# EAGLE design SDI12IB_v0.4 (EAGLE 5.11)
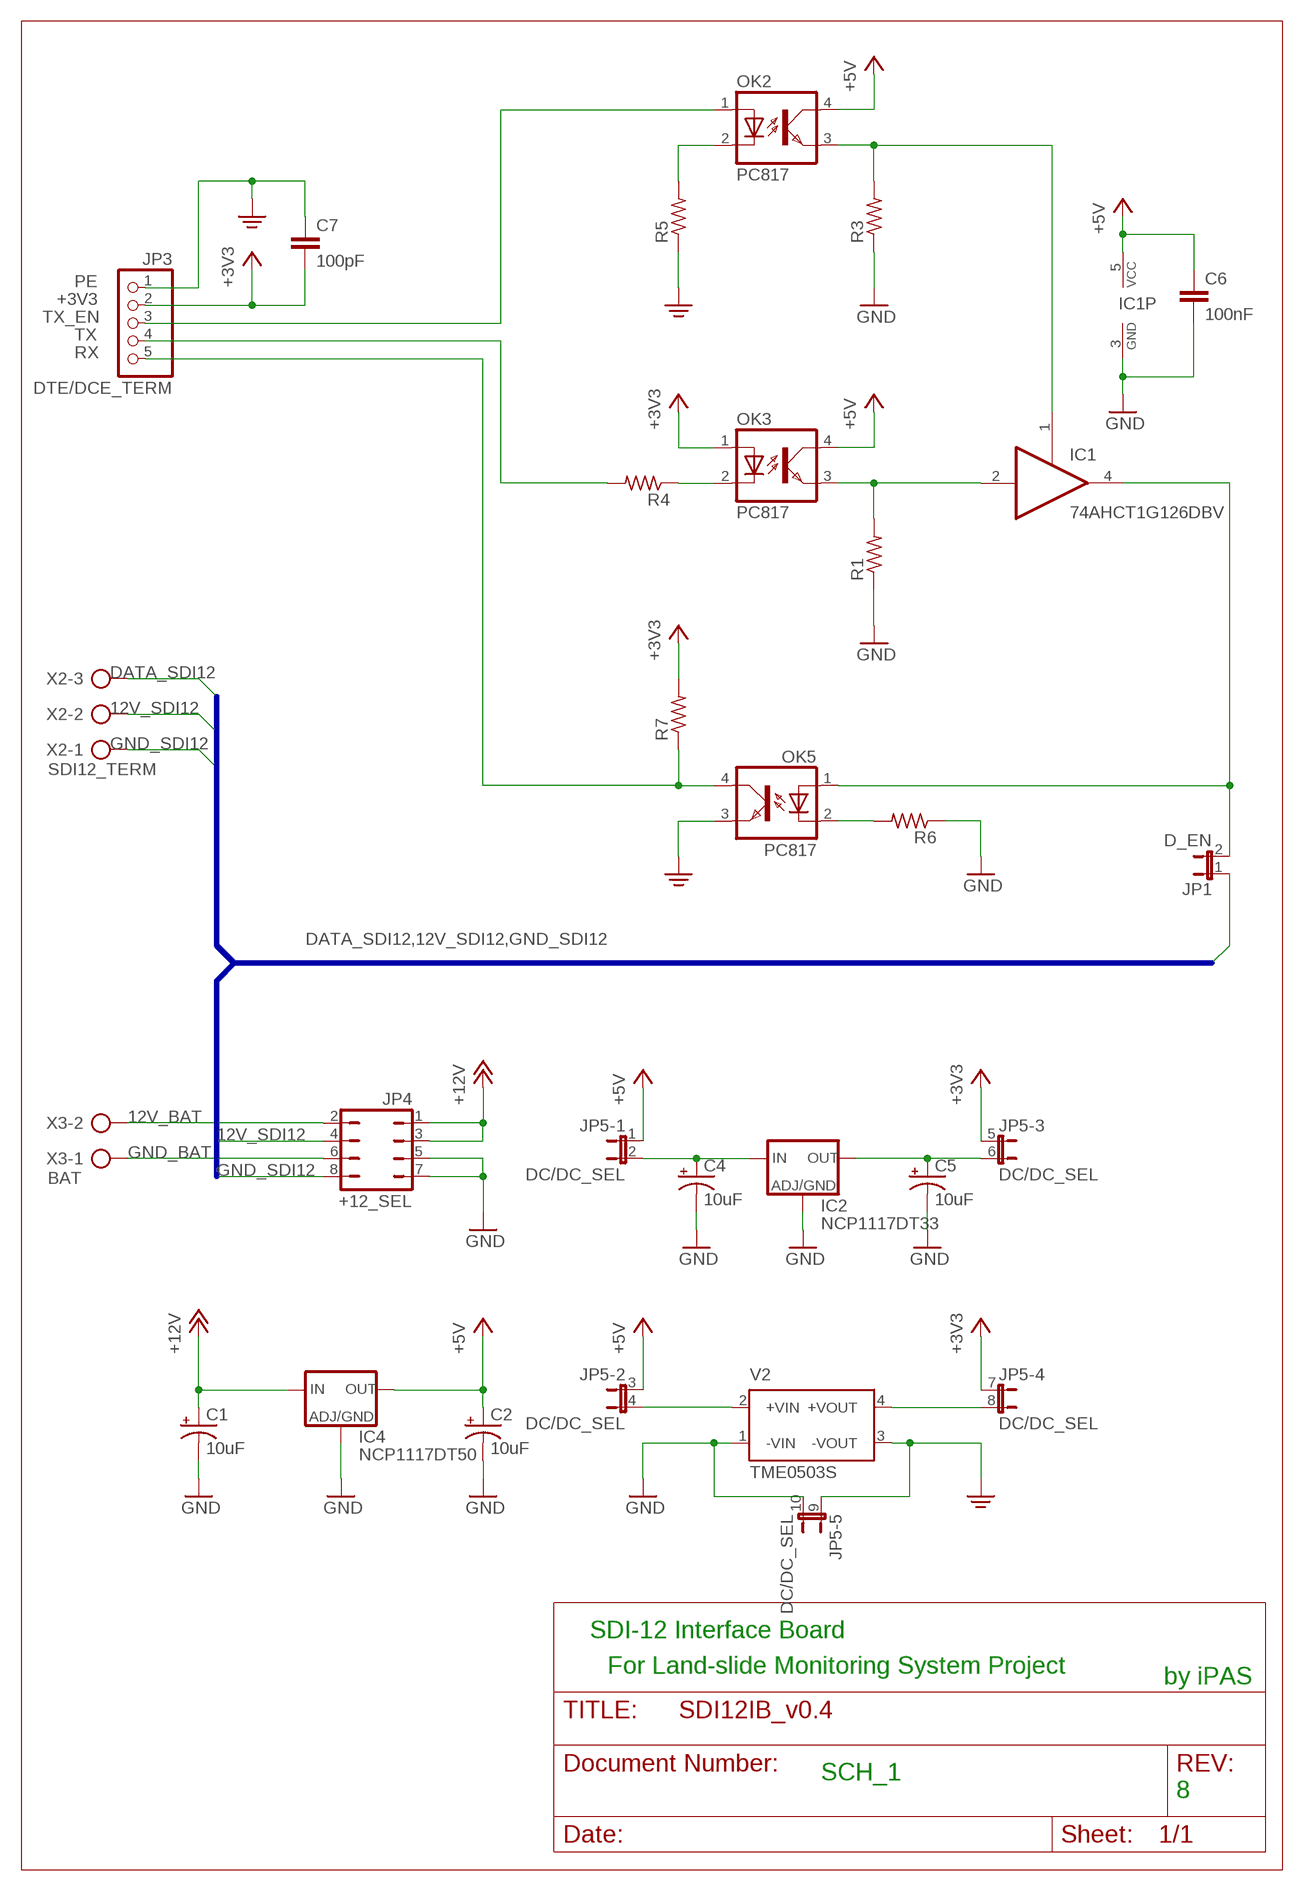
[diagram p0: schematic, sheet 1]

## Parts
C1  10uF  CPOL-USE2-5  [E2-5]
C2  10uF  CPOL-USE2-5  [E2-5]
C4  10uF  CPOL-USE2-5  [E2-5]
C5  10uF  CPOL-USE2-5  [E2-5]
C6  100nF  C-EUC1210  [C1210]
C7  100pF  C-EU050-025X075  [C050-025X075]
IC1  74AHCT1G126DBV  [SOT23-5]
IC2  NCP1117DT33  [DPACK]
IC4  NCP1117DT50  [DPACK]
JP1  D_EN  JP1E  [JP1]
JP3  DTE/DCE_TERM  PINHD-1X5  [1X05]
JP4  +12_SEL  JP4Q  [JP4Q]
JP5  DC/DC_SEL  JP5QE  [JP5Q]
OK2  PC817  [DIL04]
OK3  PC817  [DIL04]
OK5  PC817  [DIL04]
R1  R-US_0204/5  [0204/5]
R3  R-US_0204/5  [0204/5]
R4  R-US_0204/5  [0204/5]
R5  R-US_0204/5  [0204/5]
R6  R-US_0204/5  [0204/5]
R7  R-US_0204/5  [0204/5]
V2  TME0503S  [TME]
X2  SDI12_TERM  AK300/3  [AK300/3]
X3  BAT  AK300/2  [AK300/2]

## Nets
12V_BAT: JP4.2 X3.2
12V_SDI12: JP4.4 X2.2
+3V3: C7.2 JP3.2 JP5.5 JP5.7 OK3.1(A) R7.2
+5V: C2.+ C6.1 IC1.5(VCC) IC4.4(OUT) JP5.1 JP5.3 OK2.4(COL) OK3.4(COL)
+12V: C1.+ IC4.3(IN) JP4.1 JP4.3
DATA_SDI12: JP1.1 X2.3
GND: C1.- C2.- C4.- C5.- C6.2 IC1.3(GND) IC2.1(ADJ) IC4.1(ADJ) JP4.5 JP4.7 JP5.10 R1.1 R3.1 R6.1 V2.1(-VIN)
GND_BAT: JP4.6 X3.1
GND_SDI12: JP4.8 X2.1
N$1: C4.+ IC2.3(IN) JP5.2
N$2: JP5.4 V2.2(+VIN)
N$3: C5.+ IC2.4(OUT) JP5.6
N$4: IC1.2(I) OK3.3(EMIT) R1.2
N$5: OK3.2(C) R4.1
N$6: JP5.8 V2.4(+VOUT)
N$7: IC1.1(OE) OK2.3(EMIT) R3.2
N$8: OK2.2(C) R5.2
N$9: OK5.2(C) R6.2
N$10: IC1.4(O) JP1.2 OK5.1(A)
PE: C7.1 JP3.1 JP5.9 OK5.3(EMIT) R5.1 V2.3(-VOUT)
RX: JP3.5 OK5.4(COL) R7.1
TX: JP3.4 R4.2
TX_EN: JP3.3 OK2.1(A)

## Buses
DATA_SDI12,12V_SDI12,GND_SDI12

## Notes on the sheet
- SDI-12 Interface Board
- For Land-slide Monitoring System Project
- by iPAS
- SCH_1
- 8

## Library data of the parts
C1 C2 C4 C5 = rcl:CPOL-US: POLARIZED CAPACITOR, American symbol
C6 C7 = rcl:C-EU: CAPACITOR, European symbol
IC1 = 74xx-little-us:74*1G126: Single Bus Buffer Gate With 3-State Outputs
IC2 IC4 = ipas:NCP1117?*: Low drop-out positive fixed and adjustable voltage regulator
JP1 = jumper:JP1E: JUMPER
JP3 = pinhead:PINHD-1X5: PIN HEADER
JP4 = jumper:JP4Q: JUMPER
JP5 = jumper:JP5QE: JUMPER
OK2 OK3 OK5 = optocoupler:PC817: SHARP OPTO COUPLER; MPN: PC817X4J000F; OC_FARNELL: 9707727; OC_NEWARK: 97K7059
R1 R3-R7 = rcl:R-US_: RESISTOR, American symbol
V2 = ipas:TME?*: DC/DC Converter TME Series 1 Watt Source: www.tracopower.com .. tme.pdf; MPN: TME 0503S
X2 = con-ptr500:AK300/3: CONNECTOR; OC_FARNELL: unknown; OC_NEWARK: unknown
X3 = con-ptr500:AK300/2: CONNECTOR; OC_FARNELL: unknown; OC_NEWARK: unknown

## Board
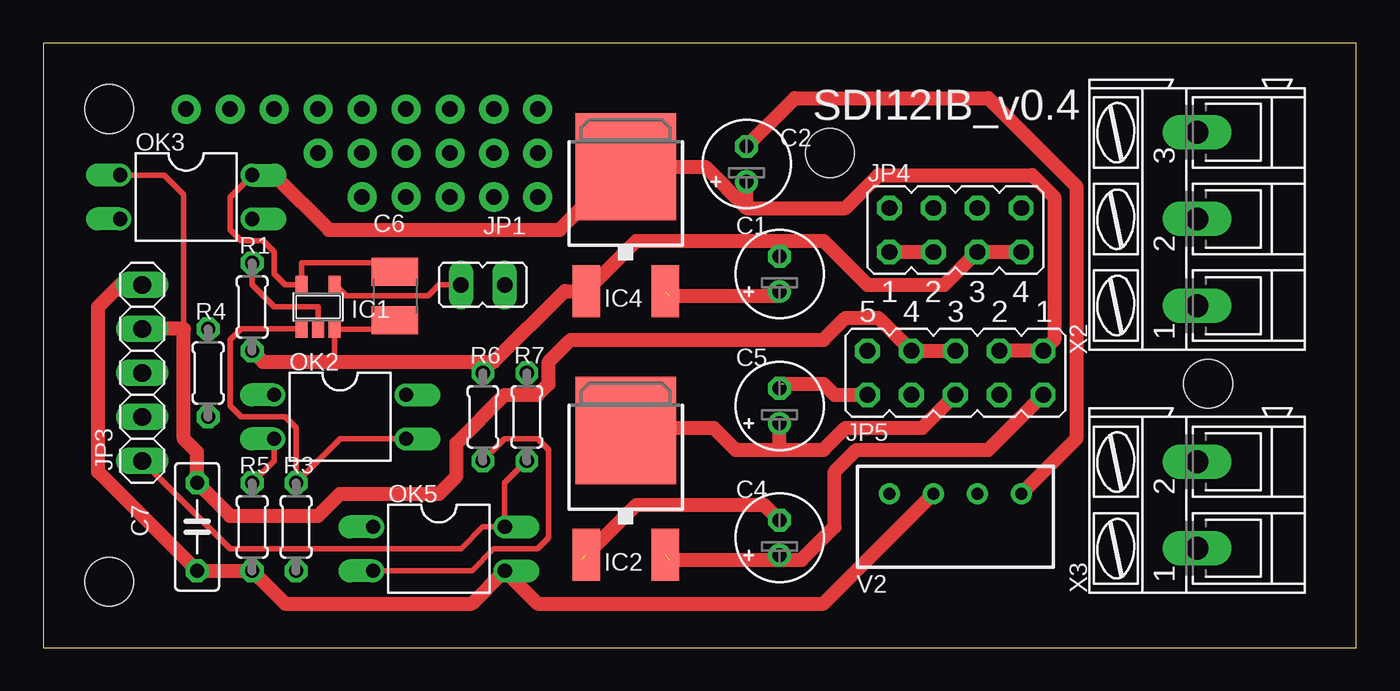
[diagram p1: board, top side]
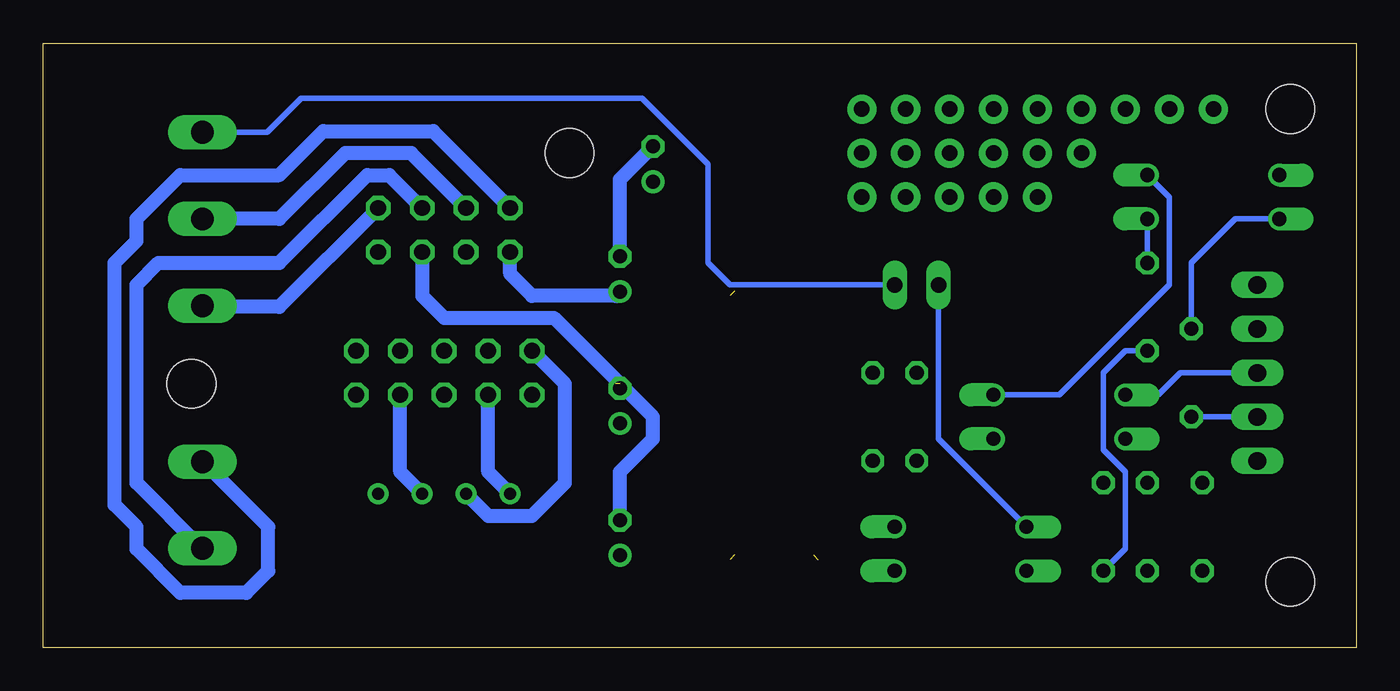
[diagram p2: board, bottom side, seen from below]

Size 75.87 x 34.91 mm. Coordinates in mm from the lower left corner, seen from the top.
Outline: 0,0 75.87,0 75.87,34.91 0,34.91 0,0
Copper layers (1*16): Top 0.035mm / dielectric 1.5mm / Bottom 0.035mm
Design rules "ipas *": minimum track width 12mil, minimum drill 24mil, track to track 10mil, track to pad 10mil, pad to pad 10mil, via to via 10mil, smd to smd 10mil, copper to edge 40mil, drill to drill 12mil, minimum pad ring 10mil, minimum via ring 8mil, stop-mask expansion 4mil, vias tented up to drill 0mil, thermal gap 10mil
Holes 2.8 mm at 3.81,3.81 45.47,28.58 67.31,15.24 3.81,31.12

### Footprints (pad centres in the part's own frame; a part is rotated, then mirrored left to right if it is on the bottom)
E2-5 = drill 0.813 pad 1.27 round: + -1.016,0 | drill 0.813 pad 1.27 octagon: - 1.016,0
C1210 = smd 1.6 x 2.7: 1 -1.4,0; 2 1.4,0
C050-025X075 = drill 0.813 octagon: 1 -2.54,0; 2 2.54,0
SOT23-5 = smd 0.69 x 0.99: 1 -0.95,-1.29; 2 0,-1.29; 3 0.95,-1.29; 4 0.95,1.3; 5 -0.95,1.3
DPACK = smd 1.6 x 3: 1 -2.28,-4.8; 3 2.28,-4.8 | smd 5.8 x 6.2: 4 0,2.38
JP1 = drill 0.914 long: 1 0,-1.27; 2 0,1.27
1X05 = drill 1.016 long: 1 -5.08,0; 2 -2.54,0; 3 0,0; 4 2.54,0; 5 5.08,0
JP4Q = drill 0.914 octagon: 1 -3.81,-1.27; 2 -3.81,1.27; 3 -1.27,-1.27; 4 -1.27,1.27; 5 1.27,-1.27; 6 1.27,1.27; 7 3.81,-1.27; 8 3.81,1.27
JP5Q = drill 0.914 octagon: 1 -5.08,-1.27; 2 -5.08,1.27; 3 -2.54,-1.27; 4 -2.54,1.27; 5 0,-1.27; 6 0,1.27; 7 2.54,-1.27; 8 2.54,1.27; 9 5.08,-1.27; 10 5.08,1.27
DIL04 = drill 0.813 offset: 1 -1.27,-3.81; 2 1.27,-3.81; 3 1.27,3.81; 4 -1.27,3.81
0204/5 = drill 0.813 octagon: 1 -2.54,0; 2 2.54,0
TME = drill 0.7 pad 1.1 round: 1 -3.81,0; 2 -1.27,0; 3 1.27,0; 4 3.81,0
AK300/3 = drill 1.321 long: 1 -5.004,0; 2 0,0; 3 5.004,0
AK300/2 = drill 1.321 long: 1 -2.515,0; 2 2.489,0

### Placement (x,y rotation side)
C1  42.55,21.59 90 top
C2  40.64,27.94 90 top
C4  42.55,6.35 90 top
C5  42.55,13.97 90 top
C6  20.32,20.32 270 top
C7  8.89,6.98 90 top
IC1  15.88,19.69 0 top
IC2  33.66,10.16 0 top
IC4  33.66,25.4 0 top
JP1  25.4,20.95 90 top
JP3  5.71,15.87 270 top
JP4  52.7,24.13 0 top
JP5  52.7,15.87 180 top
OK2  17.14,13.33 270 top
OK3  8.25,26.03 270 top
OK5  22.86,5.71 270 top
R1  12.07,19.69 90 top
R3  14.61,6.98 90 top
R4  9.53,15.87 270 top
R5  12.07,6.98 90 top
R6  25.4,13.33 270 top
R7  27.94,13.33 90 top
V2  52.7,8.89 180 top
X2  66.67,24.77 90 top
X3  66.67,8.26 90 top

### Tracks (layer width: path | path; a pad name or v marks a point on that pad's centre or on a via)
12V_BAT
  Bottom 0.813: X3.2 66.67,10.79 62.86,6.98 62.86,4.45 64.14,3.18 67.95,3.18 70.48,5.71 70.48,6.98 71.75,8.26 71.75,22.23 70.48,23.49 70.48,24.77 67.95,27.3 62.23,27.3 59.69,29.84 53.34,29.84 JP4.2
12V_SDI12
  Bottom 0.813: X2.2 62.23,24.77 58.42,28.58 54.61,28.58 JP4.4
+3V3
  Top 0.305: OK3.1 6.99,27.3 8.13,26.16 8.13,18.41 | 27.94,14.6 R7.2
  Top 0.813: JP5.5 JP5.7 48.26,19.05 46.36,19.05 45.09,17.78 30.48,17.78 29.21,16.51 29.21,15.24 28.58,14.6 27.94,14.6 26.67,14.6 23.88,11.81 23.88,9.91 22.86,8.89 17.14,8.89 15.88,7.62 10.8,7.62 C7.2 8.89,11.3 8.13,12.06 8.13,18.41 JP3.2
+5V
  Top 0.305: OK3.4 10.8,26.03 10.8,24.13 11.43,23.49 12.7,23.49 13.34,22.86 13.34,21.59 13.97,20.95 14.89,20.95 IC1.5 14.93,22.23 20.32,22.23 C6.1
  Top 0.813: JP5.3 JP5.1 58.42,17.78 58.42,26.03 57.15,27.3 48.26,27.3 46.36,25.4 40.64,25.4 | 40.64,25.4 38.26,27.78 IC4.4 33.49,27.78 29.84,24.13 16.51,24.13 13.34,27.3 OK3.4 | 40.64,25.4 C2.+
  Bottom 0.305: OK2.4 17.14,14.6 10.8,20.95 10.8,26.03 OK3.4
+12V  (1 unrouted)
  Top 0.813: JP4.1 JP4.3 | 36.2,20.32 42.55,20.32 C1.+
  Bottom 0.813: C1.+ 42.8,20.32 47.62,20.32 48.9,21.59 JP4.1
DATA_SDI12
  Bottom 0.305: X2.3 62.94,29.77 60.96,31.75 41.27,31.75 37.47,27.94 37.47,22.23 36.2,20.95 JP1.1
GND  (2 unrouted)
  Top 0.305: 25.4,16.51 R6.1 | 17.14,16.51 16.82,16.51 IC1.3 20.32,18.4 C6.2
  Top 0.813: JP4.7 JP4.5 52.07,20.95 47.62,20.95 45.09,23.49 42.55,23.49 | V2.1 59.69,12.06 59.69,26.67 54.61,31.75 43.43,31.75 C2.- | C5.- 42.8,15.24 45.09,15.24 45.72,14.6 JP5.10 | 42.55,23.49 34.27,23.49 IC4.1 30.12,20.6 26.04,16.51 25.4,16.51 17.14,16.51 12.7,16.51 R1.1 | 42.55,23.49 C1.- | 31.12,5.08 34.29,8.26 41.66,8.26 C4.-
  Bottom 0.305: R3.1 13.34,5.71 13.34,10.16 14.61,11.43 14.61,15.87 13.34,17.15 R1.1
  Bottom 0.813: 42.55,15.24 46.36,19.05 52.7,19.05 53.98,20.32 JP4.5 | C4.- 42.55,10.16 40.64,12.06 40.64,13.33 42.29,14.99 C5.- | C1.- 42.55,27.05 C2.-
GND_BAT
  Bottom 0.813: X3.1 66.67,5.71 70.48,9.53 70.48,20.95 69.22,22.23 62.23,22.23 57.15,27.3 55.88,27.3 JP4.6
GND_SDI12
  Bottom 0.813: X2.1 66.67,19.69 62.23,19.69 JP4.8
N$1  (1 unrouted)
  Top 0.813: 36.2,5.08 42.55,5.08 C4.+ 42.8,5.08 43.81,5.08 45.72,6.98 45.72,10.16 46.99,11.43 54.61,11.43 JP5.2
N$2
  Bottom 0.813: JP5.4 55.24,10.16 V2.2
N$3
  Top 0.813: JP5.6 50.8,12.7 46.36,12.7 45.09,11.43 42.55,11.43 | IC2.4 33.81,12.7 38.73,12.7 40.01,11.43 42.55,11.43 | 42.55,11.43 C5.+
N$4
  Top 0.305: R1.2 12.07,20.95 13.34,19.69 15.88,19.69 IC1.2
  Bottom 0.305: R1.2 OK3.3
N$5
  Bottom 0.305: R4.1 9.53,22.23 6.99,24.77 OK3.2
N$6
  Bottom 0.813: JP5.8 50.16,10.16 V2.4
N$7
  Top 0.305: OK2.3 17.14,12.06 R3.2 14.61,12.7 13.97,13.33 11.43,13.33 10.8,13.97 10.8,17.78 11.43,18.41 14.91,18.41 IC1.1
N$8
  Top 0.305: R5.2 13.34,10.79 OK2.2
N$9
  Top 0.305: OK5.2 24.77,4.45 26.04,5.71 28.58,5.71 29.21,6.35 29.21,11.43 28.58,12.06 26.67,12.06 R6.2
N$10
  Top 0.305: IC1.4 17.49,20.32 22.23,20.32 22.86,20.95 JP1.2
  Bottom 0.305: OK5.1 24.13,12.06 JP1.2
N$11  (via drill 0.9 pad 1.68)
  other vias: 26.04,26.03
N$12  (via drill 0.9 pad 1.68)
  other vias: 28.58,26.03
N$13  (via drill 0.9 pad 1.68)
  other vias: 23.5,26.03
N$14  (via drill 0.9 pad 1.68)
  other vias: 20.96,28.58
N$15  (via drill 0.9 pad 1.68)
  other vias: 28.58,28.58
N$16  (via drill 0.9 pad 1.68)
  other vias: 26.04,28.58
N$17  (via drill 0.9 pad 1.68)
  other vias: 23.5,28.58
N$18  (via drill 0.9 pad 1.68)
  other vias: 18.41,28.58
N$19  (via drill 0.9 pad 1.68)
  other vias: 28.58,31.12
N$20  (via drill 0.9 pad 1.68)
  other vias: 26.04,31.12
N$21  (via drill 0.9 pad 1.68)
  other vias: 23.5,31.12
N$22  (via drill 0.9 pad 1.68)
  other vias: 20.96,31.12
N$23  (via drill 0.9 pad 1.68)
  other vias: 18.41,31.12
N$24  (via drill 0.9 pad 1.68)
  other vias: 15.88,31.12
N$25  (via drill 0.9 pad 1.68)
  other vias: 13.34,31.12
N$26  (via drill 0.9 pad 1.68)
  other vias: 10.8,31.12
N$27  (via drill 0.9 pad 1.68)
  other vias: 8.25,31.12
N$28  (via drill 0.9 pad 1.68)
  other vias: 15.88,28.58
N$29  (via drill 0.9 pad 1.68)
  other vias: 20.96,26.03
N$30  (via drill 0.9 pad 1.68)
  other vias: 18.41,26.03
PE
  Top 0.813: JP3.1 4.44,20.95 3.17,19.69 3.17,10.16 C7.1 R5.1 13.97,2.54 24.77,2.54 OK5.3 28.58,2.54 45.09,2.54 V2.3
  Bottom 0.813: V2.3 50.16,7.62 47.62,7.62 45.72,9.53 45.72,15.24 JP5.9
RX
  Top 0.305: R7.1 26.67,9.53 OK5.4 25.4,6.98 24.13,5.71 10.8,5.71 JP3.5
TX
  Bottom 0.305: JP3.4 R4.2
TX_EN
  Bottom 0.305: OK2.1 11.43,14.6 10.16,15.87 JP3.3

### Text on the board
tNames: SDI12IB_v0.4